# EAGLE schematic schematic-v1 (EAGLE 8.7.0)
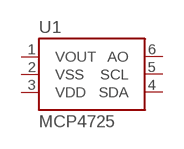
[diagram p0: schematic, sheet 1]

## Parts
U1  MCP4725  MCP4725SOT-23  [SOT23-6]
Unconnected: U1.1(VOUT) U1.2(VSS) U1.3(VDD) U1.4(SDA) U1.5(SCL) U1.6(AO)

## Library data of the parts
U1 = SparkFun-IC-Conversion:MCP4725: MCP4725 DAC Microchip 12-bit I2C DAC, SOT23-6 Datasheet <https://cdn.sparkfun.com/datasheets/BreakoutBoards/MCP4725_2009.pdf> SparkFun Products SparkFun I2C DAC Breakout - MCP4725 <https://www.sparkfun.com/products/12918> (BOB-12918); PROD_ID: IC-08886